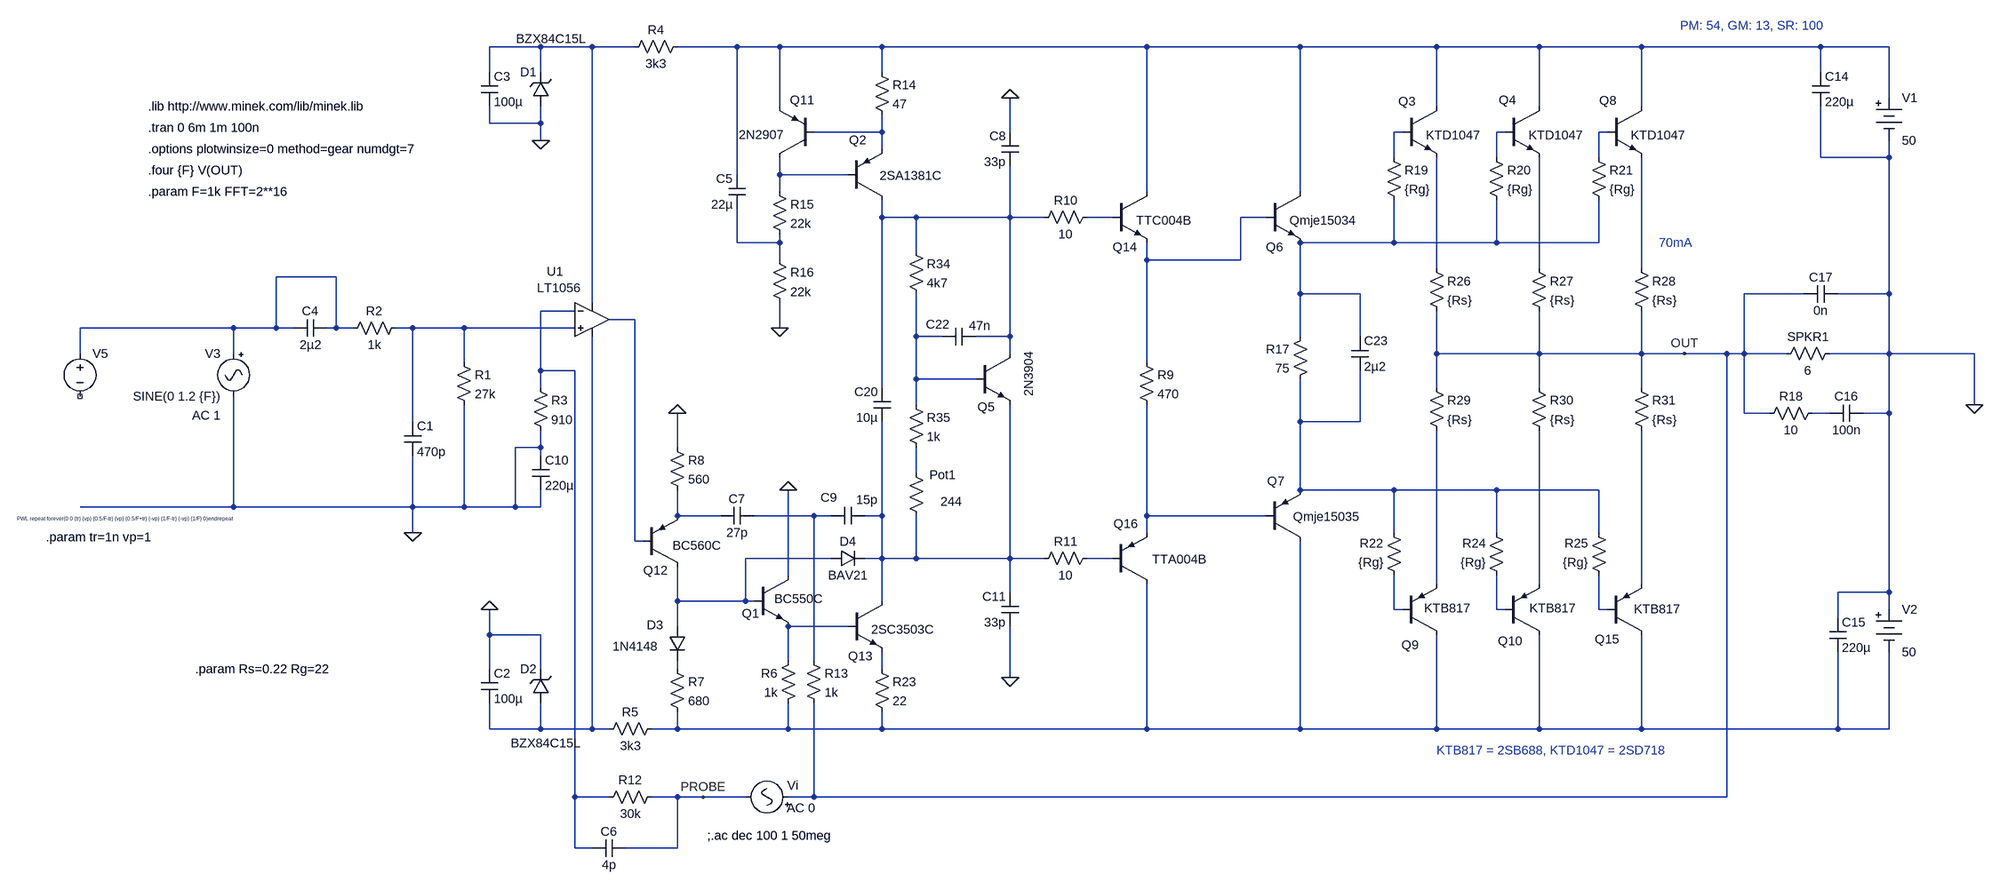
[diagram p0: schematic b44.triple.10.asc]
b44.triple.10.asc, the LTspice schematic file:
Version 4
SHEET 1 2228 832
WIRE -1952 -880 -2048 -880
WIRE -1856 -880 -1952 -880
WIRE -1776 -880 -1856 -880
WIRE -1584 -880 -1696 -880
WIRE -1504 -880 -1584 -880
WIRE -1312 -880 -1504 -880
WIRE -816 -880 -1312 -880
WIRE -528 -880 -816 -880
WIRE -272 -880 -528 -880
WIRE -80 -880 -272 -880
WIRE 112 -880 -80 -880
WIRE 448 -880 112 -880
WIRE 576 -880 448 -880
WIRE -2048 -832 -2048 -880
WIRE -1952 -832 -1952 -880
WIRE -1312 -832 -1312 -880
WIRE 448 -832 448 -880
WIRE 576 -784 576 -880
WIRE -1504 -768 -1504 -880
WIRE -272 -768 -272 -880
WIRE -80 -768 -80 -880
WIRE 112 -768 112 -880
WIRE -2048 -736 -2048 -768
WIRE -1952 -736 -1952 -768
WIRE -1952 -736 -2048 -736
WIRE -1312 -720 -1312 -752
WIRE -1312 -720 -1440 -720
WIRE -1072 -720 -1072 -784
WIRE -336 -720 -352 -720
WIRE -144 -720 -160 -720
WIRE 48 -720 32 -720
WIRE -1952 -704 -1952 -736
WIRE -1312 -688 -1312 -720
WIRE -352 -672 -352 -720
WIRE -160 -672 -160 -720
WIRE 32 -672 32 -720
WIRE 448 -672 448 -768
WIRE 576 -672 576 -704
WIRE 576 -672 448 -672
WIRE -1584 -640 -1584 -880
WIRE -1504 -640 -1504 -672
WIRE -1376 -640 -1504 -640
WIRE -1504 -608 -1504 -640
WIRE -816 -608 -816 -880
WIRE -528 -608 -528 -880
WIRE -1312 -560 -1312 -592
WIRE -1248 -560 -1312 -560
WIRE -1072 -560 -1072 -656
WIRE -1072 -560 -1248 -560
WIRE -1008 -560 -1072 -560
WIRE -880 -560 -928 -560
WIRE -592 -560 -640 -560
WIRE -1584 -512 -1584 -576
WIRE -1504 -512 -1504 -528
WIRE -1504 -512 -1584 -512
WIRE -352 -512 -352 -592
WIRE -352 -512 -528 -512
WIRE -160 -512 -160 -592
WIRE -160 -512 -352 -512
WIRE 32 -512 32 -592
WIRE 32 -512 -160 -512
WIRE -1248 -496 -1248 -560
WIRE -1504 -480 -1504 -512
WIRE -816 -480 -816 -512
WIRE -640 -480 -640 -560
WIRE -640 -480 -816 -480
WIRE -272 -464 -272 -672
WIRE -80 -464 -80 -672
WIRE 112 -464 112 -672
WIRE -2336 -448 -2448 -448
WIRE -528 -416 -528 -512
WIRE -416 -416 -528 -416
WIRE 416 -416 304 -416
WIRE 576 -416 576 -672
WIRE 576 -416 480 -416
WIRE -1856 -400 -1856 -880
WIRE -1888 -384 -1952 -384
WIRE -1776 -368 -1824 -368
WIRE -2528 -352 -2816 -352
WIRE -2448 -352 -2448 -448
WIRE -2448 -352 -2528 -352
WIRE -2416 -352 -2448 -352
WIRE -2336 -352 -2336 -448
WIRE -2336 -352 -2352 -352
WIRE -2304 -352 -2336 -352
WIRE -2192 -352 -2224 -352
WIRE -2096 -352 -2192 -352
WIRE -1888 -352 -2096 -352
WIRE -1504 -352 -1504 -400
WIRE -1248 -336 -1248 -416
WIRE -1200 -336 -1248 -336
WIRE -1072 -336 -1072 -560
WIRE -1072 -336 -1136 -336
WIRE -528 -336 -528 -416
WIRE -416 -336 -416 -416
WIRE -2816 -304 -2816 -352
WIRE -2528 -304 -2528 -352
WIRE -1072 -304 -1072 -336
WIRE -272 -304 -272 -384
WIRE -80 -304 -80 -384
WIRE -80 -304 -272 -304
WIRE 112 -304 112 -384
WIRE 112 -304 -80 -304
WIRE 192 -304 112 -304
WIRE 272 -304 192 -304
WIRE 304 -304 304 -416
WIRE 304 -304 272 -304
WIRE 384 -304 304 -304
WIRE 576 -304 576 -416
WIRE 576 -304 464 -304
WIRE 736 -304 576 -304
WIRE -2096 -288 -2096 -352
WIRE -816 -288 -816 -480
WIRE -1952 -272 -1952 -384
WIRE -1888 -272 -1952 -272
WIRE -1248 -256 -1248 -336
WIRE -1136 -256 -1248 -256
WIRE -1952 -240 -1952 -272
WIRE -1312 -240 -1312 -560
WIRE -272 -240 -272 -304
WIRE -80 -240 -80 -304
WIRE 112 -240 112 -304
WIRE -1248 -208 -1248 -256
WIRE 736 -208 736 -304
WIRE 304 -192 304 -304
WIRE 352 -192 304 -192
WIRE 464 -192 432 -192
WIRE 576 -192 576 -304
WIRE 576 -192 528 -192
WIRE -2192 -176 -2192 -352
WIRE -528 -176 -528 -256
WIRE -416 -176 -416 -272
WIRE -416 -176 -528 -176
WIRE -1952 -128 -1952 -160
WIRE -1952 -128 -2000 -128
WIRE -1696 -128 -1696 -192
WIRE -1952 -112 -1952 -128
WIRE -1248 -80 -1248 -128
WIRE -528 -48 -528 -176
WIRE -352 -48 -528 -48
WIRE -160 -48 -352 -48
WIRE 32 -48 -160 -48
WIRE -2528 -16 -2528 -224
WIRE -2528 -16 -2816 -16
WIRE -2192 -16 -2192 -112
WIRE -2192 -16 -2528 -16
WIRE -2096 -16 -2096 -208
WIRE -2096 -16 -2192 -16
WIRE -2000 -16 -2000 -128
WIRE -2000 -16 -2096 -16
WIRE -1952 -16 -1952 -48
WIRE -1952 -16 -2000 -16
WIRE -1696 0 -1696 -48
WIRE -1616 0 -1696 0
WIRE -1440 0 -1552 0
WIRE -1408 0 -1440 0
WIRE -1312 0 -1312 -176
WIRE -1312 0 -1344 0
WIRE -816 0 -816 -208
WIRE -592 0 -816 0
WIRE -2192 32 -2192 -16
WIRE -816 32 -816 0
WIRE -352 32 -352 -48
WIRE -160 32 -160 -48
WIRE 32 32 32 -48
WIRE -1776 48 -1776 -368
WIRE -1760 48 -1776 48
WIRE -1408 80 -1568 80
WIRE -1312 80 -1312 0
WIRE -1312 80 -1344 80
WIRE -1248 80 -1248 0
WIRE -1248 80 -1312 80
WIRE -1072 80 -1072 -208
WIRE -1072 80 -1248 80
WIRE -1008 80 -1072 80
WIRE -880 80 -928 80
WIRE -1488 112 -1488 -48
WIRE -272 128 -272 -160
WIRE -80 128 -80 -160
WIRE 112 128 112 -160
WIRE -1072 144 -1072 80
WIRE 576 144 576 -192
WIRE 576 144 480 144
WIRE -1696 160 -1696 96
WIRE -1568 160 -1568 80
WIRE -1568 160 -1696 160
WIRE -1552 160 -1568 160
WIRE -1312 160 -1312 80
WIRE -352 176 -352 112
WIRE -336 176 -352 176
WIRE -160 176 -160 112
WIRE -144 176 -160 176
WIRE 32 176 32 112
WIRE 48 176 32 176
WIRE 576 176 576 144
WIRE 480 192 480 144
WIRE -1696 208 -1696 160
WIRE -1376 208 -1488 208
WIRE -2048 224 -2048 176
WIRE -1952 224 -2048 224
WIRE -1488 272 -1488 208
WIRE -1440 272 -1440 0
WIRE -2048 288 -2048 224
WIRE -1952 288 -1952 224
WIRE -1696 288 -1696 272
WIRE -1312 288 -1312 256
WIRE -1072 304 -1072 208
WIRE -2048 400 -2048 352
WIRE -1952 400 -1952 352
WIRE -1952 400 -2048 400
WIRE -1856 400 -1856 -336
WIRE -1856 400 -1952 400
WIRE -1824 400 -1856 400
WIRE -1696 400 -1696 368
WIRE -1696 400 -1744 400
WIRE -1488 400 -1488 352
WIRE -1488 400 -1696 400
WIRE -1312 400 -1312 368
WIRE -1312 400 -1488 400
WIRE -816 400 -816 128
WIRE -816 400 -1312 400
WIRE -528 400 -528 48
WIRE -528 400 -816 400
WIRE -272 400 -272 224
WIRE -272 400 -528 400
WIRE -80 400 -80 224
WIRE -80 400 -272 400
WIRE 112 400 112 224
WIRE 112 400 -80 400
WIRE 480 400 480 256
WIRE 480 400 112 400
WIRE 576 400 576 256
WIRE 576 400 480 400
WIRE -1888 528 -1888 -272
WIRE -1824 528 -1888 528
WIRE -1696 528 -1744 528
WIRE -1648 528 -1696 528
WIRE -1568 528 -1648 528
WIRE -1440 528 -1440 352
WIRE -1440 528 -1488 528
WIRE 272 528 272 -304
WIRE 272 528 -1440 528
WIRE -1888 624 -1888 528
WIRE -1856 624 -1888 624
WIRE -1696 624 -1696 528
WIRE -1696 624 -1792 624
FLAG 736 -208 0
FLAG 192 -304 OUT
FLAG -1648 528 PROBE
FLAG -2192 32 0
FLAG -2048 176 0
FLAG -1952 -704 0
FLAG -1696 -192 0
FLAG -1504 -352 0
FLAG -1488 -48 0
FLAG -1072 -784 0
FLAG -1072 304 0
SYMBOL res -512 -352 M0
SYMATTR InstName R17
SYMATTR Value 75
SYMATTR SpiceLine pwr=0.5
SYMBOL Misc\\battery 576 -800 R0
WINDOW 123 0 0 Left 2
WINDOW 39 0 0 Left 2
SYMATTR InstName V1
SYMATTR Value 50
SYMBOL Misc\\battery 576 160 R0
WINDOW 123 0 0 Left 2
WINDOW 39 0 0 Left 2
SYMATTR InstName V2
SYMATTR Value 50
SYMBOL res 480 -320 R90
WINDOW 0 0 56 VBottom 2
WINDOW 3 32 56 VTop 2
SYMATTR InstName SPKR1
SYMATTR Value 6
SYMBOL cap 432 -832 R0
SYMATTR InstName C14
SYMATTR Value 220µ
SYMATTR SpiceLine V=63
SYMBOL cap 464 192 R0
SYMATTR InstName C15
SYMATTR Value 220µ
SYMATTR SpiceLine V=63
SYMBOL res 336 -176 R270
WINDOW 0 32 56 VTop 2
WINDOW 3 0 56 VBottom 2
SYMATTR InstName R18
SYMATTR Value 10
SYMATTR SpiceLine pwr=2
SYMBOL cap 464 -176 R270
WINDOW 0 32 32 VTop 2
WINDOW 3 0 32 VBottom 2
SYMATTR InstName C16
SYMATTR Value 100n
SYMATTR SpiceLine V=200
SYMBOL res -368 -688 R0
SYMATTR InstName R19
SYMATTR Value {Rg}
SYMBOL res -176 -688 R0
SYMATTR InstName R20
SYMATTR Value {Rg}
SYMBOL res 16 -688 R0
SYMATTR InstName R21
SYMATTR Value {Rg}
SYMBOL res -336 128 R180
WINDOW 0 36 76 Left 2
WINDOW 3 36 40 Left 2
SYMATTR InstName R22
SYMATTR Value {Rg}
SYMBOL res -144 128 R180
WINDOW 0 36 76 Left 2
WINDOW 3 36 40 Left 2
SYMATTR InstName R24
SYMATTR Value {Rg}
SYMBOL res 48 128 R180
WINDOW 0 36 76 Left 2
WINDOW 3 36 40 Left 2
SYMATTR InstName R25
SYMATTR Value {Rg}
SYMBOL res -288 -480 R0
SYMATTR InstName R26
SYMATTR Value {Rs}
SYMATTR SpiceLine pwr=2
SYMBOL res -96 -480 R0
SYMATTR InstName R27
SYMATTR Value {Rs}
SYMATTR SpiceLine pwr=2
SYMBOL res 96 -480 R0
SYMATTR InstName R28
SYMATTR Value {Rs}
SYMATTR SpiceLine pwr=2
SYMBOL cap 416 -400 R270
WINDOW 0 32 32 VTop 2
WINDOW 3 0 32 VBottom 2
SYMATTR InstName C17
SYMATTR Value 0n
SYMBOL res -288 -256 R0
SYMATTR InstName R29
SYMATTR Value {Rs}
SYMATTR SpiceLine pwr=2
SYMBOL res -96 -256 R0
SYMATTR InstName R30
SYMATTR Value {Rs}
SYMATTR SpiceLine pwr=2
SYMBOL res 96 -256 R0
SYMATTR InstName R31
SYMATTR Value {Rs}
SYMATTR SpiceLine pwr=2
SYMBOL Misc\\signal -1472 528 M270
WINDOW 123 -21 19 VLeft 2
WINDOW 3 24 104 Invisible 2
WINDOW 0 22 18 VLeft 2
WINDOW 39 0 0 Left 0
SYMATTR Value2 AC 0
SYMATTR Value 0
SYMATTR InstName Vi
SYMBOL res -1264 -512 R0
SYMATTR InstName R34
SYMATTR Value 4k7
SYMBOL res -1264 -96 R0
WINDOW 0 41 20 Left 2
WINDOW 3 62 70 Left 2
SYMATTR InstName Pot1
SYMATTR Value 244
SYMBOL res -1264 -224 R0
SYMATTR InstName R35
SYMATTR Value 1k
SYMBOL npn -1136 -304 R0
WINDOW 0 3 100 Left 2
WINDOW 3 99 -4 VRight 2
SYMATTR InstName Q5
SYMATTR Value 2N3904
SYMBOL npn -592 -608 R0
WINDOW 0 0 104 Left 2
WINDOW 3 44 54 Left 2
SYMATTR InstName Q6
SYMATTR Value Qmje15034
SYMBOL pnp -592 48 M180
WINDOW 0 2 113 Left 2
WINDOW 3 176 46 Right 2
SYMATTR InstName Q7
SYMATTR Value Qmje15035
SYMBOL cap -1200 -320 R270
WINDOW 0 23 -8 VTop 2
WINDOW 3 52 71 VBottom 2
SYMATTR InstName C22
SYMATTR Value 47n
SYMBOL cap -432 -336 R0
SYMATTR InstName C23
SYMATTR Value 2µ2
SYMATTR SpiceLine V=100
SYMBOL cap -1296 -240 M0
SYMATTR InstName C20
SYMATTR Value 10µ
SYMATTR SpiceLine V=100
SYMBOL npn -336 -768 R0
WINDOW 0 -8 -9 Left 2
WINDOW 3 44 54 Left 2
SYMATTR InstName Q3
SYMATTR Value KTD1047
SYMBOL npn -144 -768 R0
WINDOW 0 -12 -12 Left 2
WINDOW 3 44 54 Left 2
SYMATTR InstName Q4
SYMATTR Value KTD1047
SYMBOL npn 48 -768 R0
WINDOW 0 -15 -11 Left 2
WINDOW 3 44 54 Left 2
SYMATTR InstName Q8
SYMATTR Value KTD1047
SYMBOL pnp -336 224 M180
WINDOW 0 -2 -19 Left 2
WINDOW 3 127 50 Right 2
SYMATTR InstName Q9
SYMATTR Value KTB817
SYMBOL pnp -144 224 M180
WINDOW 0 -13 -11 Left 2
WINDOW 3 133 50 Right 2
SYMATTR InstName Q10
SYMATTR Value KTB817
SYMBOL pnp 48 224 M180
WINDOW 0 -24 -8 Left 2
WINDOW 3 137 49 Right 2
SYMATTR InstName Q15
SYMATTR Value KTB817
SYMBOL res -2112 -304 R0
SYMATTR InstName R1
SYMATTR Value 27k
SYMBOL cap -2208 -176 R0
SYMATTR InstName C1
SYMATTR Value 470p
SYMBOL res -2208 -368 R90
WINDOW 0 0 56 VBottom 2
WINDOW 3 32 56 VTop 2
SYMATTR InstName R2
SYMATTR Value 1k
SYMBOL Misc\\signal -2528 -320 M0
WINDOW 123 24 132 Left 2
WINDOW 39 0 0 Left 0
SYMATTR Value2 AC 1
SYMATTR InstName V3
SYMATTR Value SINE(0 1.2 {F})
SYMBOL Opamps\\LT1056 -1856 -432 R0
WINDOW 0 -85 -26 Left 2
WINDOW 3 -103 5 Left 2
SYMATTR InstName U1
SYMBOL res -1968 -256 R0
SYMATTR InstName R3
SYMATTR Value 910
SYMBOL res -1680 -896 R90
WINDOW 0 0 56 VBottom 2
WINDOW 3 32 56 VTop 2
SYMATTR InstName R4
SYMATTR Value 3k3
SYMATTR SpiceLine pwr=1
SYMBOL res -1728 384 R90
WINDOW 0 0 56 VBottom 2
WINDOW 3 32 56 VTop 2
SYMATTR InstName R5
SYMATTR Value 3k3
SYMATTR SpiceLine pwr=1
SYMBOL cap -2064 288 R0
SYMATTR InstName C2
SYMATTR Value 100µ
SYMATTR SpiceLine V=25
SYMBOL cap -2064 -832 R0
SYMATTR InstName C3
SYMATTR Value 100µ
SYMATTR SpiceLine V=25
SYMBOL zener -1936 -768 R180
WINDOW 0 24 64 Left 2
WINDOW 3 -69 127 Left 2
SYMATTR InstName D1
SYMATTR Value BZX84C15L
SYMATTR Description Diode
SYMATTR Type diode
SYMBOL zener -1936 352 R180
WINDOW 0 24 64 Left 2
WINDOW 3 -59 -75 Left 2
SYMATTR InstName D2
SYMATTR Value BZX84C15L
SYMATTR Description Diode
SYMATTR Type diode
SYMBOL res -1472 256 M0
SYMATTR InstName R6
SYMATTR Value 1k
SYMBOL res -1712 272 R0
SYMATTR InstName R7
SYMATTR Value 680
SYMBOL npn -1552 112 R0
WINDOW 0 -23 72 Left 2
WINDOW 3 38 44 Left 2
SYMATTR InstName Q1
SYMATTR Value BC550C
SYMBOL cap -2352 -368 R90
WINDOW 0 0 32 VBottom 2
WINDOW 3 32 32 VTop 2
SYMATTR InstName C4
SYMATTR Value 2µ2
SYMBOL res -1712 -144 R0
SYMATTR InstName R8
SYMATTR Value 560
SYMBOL diode -1712 208 R0
WINDOW 0 -41 -3 Left 2
WINDOW 3 -105 37 Left 2
SYMATTR InstName D3
SYMATTR Value 1N4148
SYMBOL res -1728 512 R90
WINDOW 0 0 56 VBottom 2
WINDOW 3 32 56 VTop 2
SYMATTR InstName R12
SYMATTR Value 30k
SYMATTR SpiceLine pwr=0.5
SYMBOL res -1456 256 R0
SYMATTR InstName R13
SYMATTR Value 1k
SYMBOL pnp -1440 -672 R180
WINDOW 0 -1 108 Left 2
WINDOW 3 141 43 Right 2
SYMATTR InstName Q11
SYMATTR Value 2N2907
SYMBOL res -1328 -848 R0
SYMATTR InstName R14
SYMATTR Value 47
SYMBOL res -1520 -624 R0
SYMATTR InstName R15
SYMATTR Value 22k
SYMBOL res -1520 -496 R0
SYMATTR InstName R16
SYMATTR Value 22k
SYMBOL cap -1568 -640 M0
SYMATTR InstName C5
SYMATTR Value 22µ
SYMATTR SpiceLine V=25
SYMBOL cap -1792 608 R90
WINDOW 0 0 32 VBottom 2
WINDOW 3 32 32 VTop 2
SYMATTR InstName C6
SYMATTR Value 4p
SYMBOL pnp -1760 96 M180
WINDOW 0 0 -7 Left 2
WINDOW 3 146 40 Right 2
SYMATTR InstName Q12
SYMATTR Value BC560C
SYMBOL res -1328 272 R0
SYMATTR InstName R23
SYMATTR Value 22
SYMBOL cap -1552 -16 R90
WINDOW 0 0 32 VBottom 2
WINDOW 3 32 32 VTop 2
SYMATTR InstName C7
SYMATTR Value 27p
SYMBOL cap -1344 -16 R90
WINDOW 0 -2 68 VBottom 2
WINDOW 3 -29 -4 VTop 2
SYMATTR InstName C9
SYMATTR Value 15p
SYMBOL diode -1408 96 R270
WINDOW 0 32 32 VTop 2
WINDOW 3 0 32 VBottom 2
SYMATTR InstName D4
SYMATTR Value BAV21
SYMBOL cap -1968 -112 R0
SYMATTR InstName C10
SYMATTR Value 220µ
SYMBOL res -832 -304 R0
SYMATTR InstName R9
SYMATTR Value 470
SYMBOL npn -880 -608 R0
WINDOW 0 0 104 Left 2
WINDOW 3 44 54 Left 2
SYMATTR InstName Q14
SYMATTR Value TTC004B
SYMBOL pnp -880 128 M180
WINDOW 0 2 113 Left 2
WINDOW 3 176 46 Right 2
SYMATTR InstName Q16
SYMATTR Value TTA004B
SYMBOL cap -1056 -720 M0
SYMATTR InstName C8
SYMATTR Value 33p
SYMATTR SpiceLine V=100
SYMBOL cap -1056 144 M0
SYMATTR InstName C11
SYMATTR Value 33p
SYMATTR SpiceLine V=100
SYMBOL voltage -2816 -320 R0
WINDOW 3 -118 326 Left 0
SYMATTR Value PWL repeat forever(0 0 {tr} {vp} {0.5/F-tr} {vp} {0.5/F+tr} {-vp} {1/F-tr} {-vp} {1/F} 0)endrepeat
SYMATTR InstName V5
SYMBOL res -912 -576 R90
WINDOW 0 0 56 VBottom 2
WINDOW 3 32 56 VTop 2
SYMATTR InstName R10
SYMATTR Value 10
SYMBOL res -912 64 R90
WINDOW 0 0 56 VBottom 2
WINDOW 3 32 56 VTop 2
SYMATTR InstName R11
SYMATTR Value 10
SYMBOL npn -1376 160 R0
WINDOW 0 0 104 Left 2
WINDOW 3 44 54 Left 2
SYMATTR InstName Q13
SYMATTR Value 2SC3503C
SYMBOL pnp -1376 -592 M180
WINDOW 0 2 113 Left 2
WINDOW 3 176 46 Right 2
SYMATTR InstName Q2
SYMATTR Value 2SA1381C
TEXT -1640 600 Left 2 !;.ac dec 100 1 50meg
TEXT 144 -512 Left 2 ;70mA
TEXT -2688 -768 Left 2 !.lib http://www.minek.com/lib/minek.lib
TEXT -2688 -728 Left 2 !.tran 0 6m 1m 100n
TEXT -2688 -688 Left 2 !.options plotwinsize=0 method=gear numdgt=7
TEXT -2688 -648 Left 2 !.four {F} V(OUT)
TEXT -2688 -608 Left 2 !.param F=1k FFT=2**16
TEXT -2600 288 Left 2 !.param Rs=0.22 Rg=22
TEXT 184 -920 Left 2 ;PM: 54, GM: 13, SR: 100
TEXT -2880 40 Left 2 !.param tr=1n vp=1
TEXT -272 440 Left 2 ;KTB817 = 2SB688, KTD1047 = 2SD718

The netlist it stands for:
* b44.triple.10.asc
R17 N012 N022 75 pwr=0.5
V1 N002 0 50
V2 0 N040 50
R§SPKR1 0 OUT 6
C14 N002 0 220µ V=63
C15 0 N040 220µ V=63
R18 OUT N021 10 pwr=2
C16 N021 0 100n V=200
R19 N004 N012 {Rg}
R20 N005 N012 {Rg}
R21 N006 N012 {Rg}
R22 N033 N022 {Rg}
R24 N034 N022 {Rg}
R25 N035 N022 {Rg}
R26 N013 OUT {Rs} pwr=2
R27 N014 OUT {Rs} pwr=2
R28 N015 OUT {Rs} pwr=2
C17 OUT 0 0n
R29 OUT N030 {Rs} pwr=2
R30 OUT N031 {Rs} pwr=2
R31 OUT N032 {Rs} pwr=2
Vi OUT PROBE 0 AC 0
R34 N008 N020 4k7
R§Pot1 N023 N026 244
R35 N020 N023 1k
Q5 N008 N020 N026 0 2N3904
Q6 N002 N010 N012 0 Qmje15034
Q7 N040 N027 N022 0 Qmje15035
C22 N020 N008 47n
C23 N012 N022 2µ2 V=100
C20 N008 N026 10µ V=100
Q3 N002 N004 N013 0 KTD1047
Q4 N002 N005 N014 0 KTD1047
Q8 N002 N006 N015 0 KTD1047
Q9 N040 N033 N030 0 KTB817
Q10 N040 N034 N031 0 KTB817
Q15 N040 N035 N032 0 KTB817
R1 N019 0 27k
C1 N019 0 470p
R2 N019 N016 1k
V3 N016 0 SINE(0 1.2 {F}) AC 1
XU1 N019 N017 N001 N039 N018 LT1056  ; pins In+ In- V+ V- OUT
R3 N017 0 910
R4 N002 N001 3k3 pwr=1
R5 N040 N039 3k3 pwr=1
C2 0 N039 100µ V=25
C3 N001 0 100µ V=25
D1 0 N001 BZX84C15L
D2 N039 0 BZX84C15L
R6 N036 N040 1k
R7 N037 N040 680
Q1 0 N028 N036 0 BC550C
C4 N016 N016 2µ2
R8 0 N024 560
D3 N028 N037 1N4148
R12 PROBE N017 30k pwr=0.5
R13 N025 OUT 1k
Q11 N007 N003 N002 0 2N2907
R14 N002 N003 47
R15 N007 N011 22k
R16 N011 0 22k
C5 N002 N011 22µ V=25
C6 PROBE N017 4p
Q12 N028 N018 N024 0 BC560C
R23 N038 N040 22
C7 N025 N024 27p
C9 N026 N025 15p
D4 N028 N026 BAV21
C10 0 0 220µ
R9 N010 N027 470
Q14 N002 N009 N010 0 TTC004B
Q16 N040 N029 N027 0 TTA004B
C8 0 N008 33p V=100
C11 N026 0 33p V=100
V5 N016 NC_01 PWL repeat forever(0 0 {tr} {vp} {0.5/F-tr} {vp} {0.5/F+tr} {-vp} {1/F-tr} {-vp} {1/F} 0)endrepeat
R10 N009 N008 10
R11 N029 N026 10
Q13 N026 N036 N038 0 2SC3503C
Q2 N008 N007 N003 0 2SA1381C
.model D D
.lib standard.dio
.model NPN NPN
.model PNP PNP
.lib standard.bjt
;.ac dec 100 1 50meg
* 70mA
.lib http://www.minek.com/lib/minek.lib
.tran 0 6m 1m 100n
.options plotwinsize=0 method=gear numdgt=7
.four {F} V(OUT)
.param F=1k FFT=2**16
.param Rs=0.22 Rg=22
* PM: 54, GM: 13, SR: 100
.param tr=1n vp=1
* KTB817 = 2SB688, KTD1047 = 2SD718
.backanno
.end